# Altium schematic sheet Main.SchDoc
size 594 x 420 mm; SheetNumber: 1; SheetTotal: 1
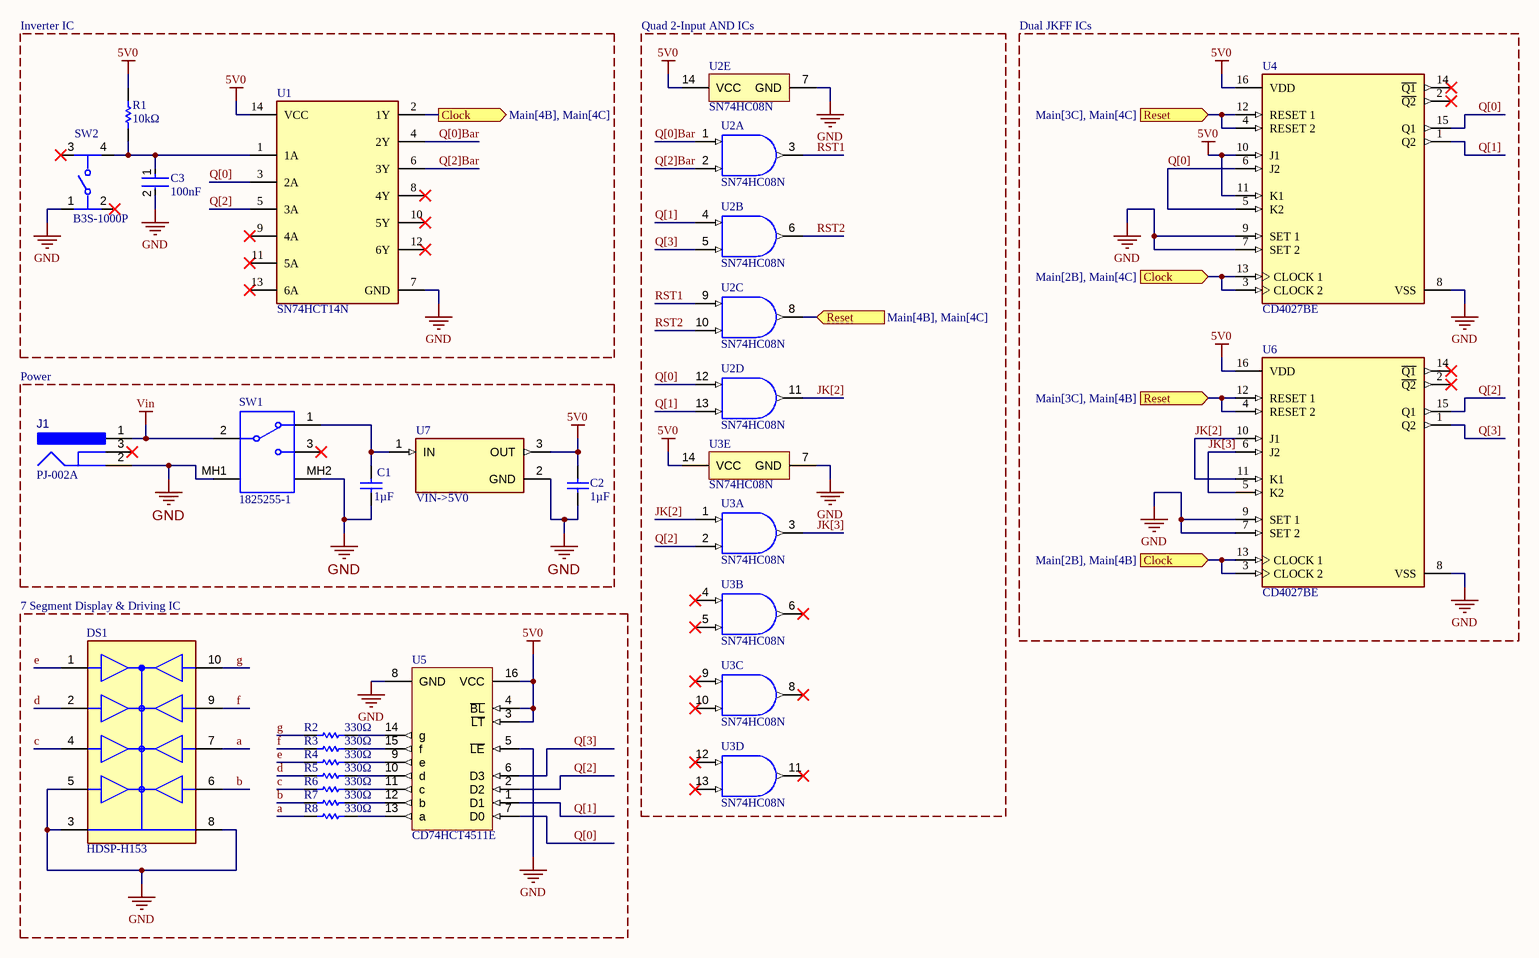
[diagram p0: Main.SchDoc]

## Parts
C1  1µF  [CAPC3216X110X50LL20T25]
C2  1µF  [CAPC3216X110X50LL20T25]
C3  100nF  [FP-C1206C-EB-MFG]
DS1  HDSP-H153  [FP-HDSP-H153-MFG]
J1  PJ-002A  [CUI-PJ-002A_V]
R1  10kΩ  [RESC3116X65X40ML10T20]
R2  330Ω  [RESC3216X70X50NL05T20]
R3  330Ω  [RESC3216X70X50NL05T20]
R4  330Ω  [RESC3216X70X50NL05T20]
R5  330Ω  [RESC3216X70X50NL05T20]
R6  330Ω  [RESC3216X70X50NL05T20]
R7  330Ω  [RESC3216X70X50NL05T20]
R8  330Ω  [RESC3216X70X50NL05T20]
SW1  1825255-1  [TECO-1825255-1_V]
SW2  B3S-1000P  [FP-B3S-1000P-MFG]
U1  SN74HCT14N  [FP-N0014A-MFG]
U2  SN74HC08N  [N0014A]  (parts A,B,C,D,E of 5)
U3  SN74HC08N  [N0014A]  (parts A,B,C,D,E of 5)
U4  CD4027BE  [FP-N0016A-MFG]
U5  CD74HCT4511E  [N0016A]
U6  CD4027BE  [FP-N0016A-MFG]
U7  VIN->5V0  [DPAK229P990X238-4N]

## Blocks framed on the sheet
Inverter IC: C3 R1 SW2 U1
Quad 2-Input AND ICs: U2 U3
Dual JKFF ICs: U4 U6
Power: C1 C2 J1 SW1 U7
7 Segment Display & Driving IC: DS1 R2-R8 U5

## Ports
Clock (in, see Main[2B], Main[4B]), Clock (in, see Main[2B], Main[4C]), Clock (out, see Main[4B], Main[4C]), Reset (in, see Main[3C], Main[4B]), Reset (in, see Main[3C], Main[4C]), Reset (in, see Main[4B], Main[4C])

## Nets
5V0: C2.1 R1.2 U1.14(VCC) U2.14(VCC) U3.14(VCC) U4.10(J1) U4.11(K1) U4.16(VDD) U5.3(~{LT}) U5.4(~{BL}) U5.16(VCC) U6.16(VDD) U7.3(OUT)
GND: C1.2 C2.2 C3.2 DS1.3(C) DS1.5(ANODE_DP) DS1.8(C) J1.2 SW1.MH1 SW1.MH2 SW2.1 U1.7(GND) U2.7(GND) U3.7(GND) U4.7(SET_2) U4.8(VSS) U4.9(SET_1) U5.5(~{LE}) U5.8(GND) U6.7(SET_2) U6.8(VSS) U6.9(SET_1) U7.2(GND)
Vin: J1.1 SW1.2
a: DS1.7(ANODE_a) R8.1
b: DS1.6(ANODE_b) R7.1
c: DS1.4(ANODE_c) R6.1
Clock: U1.2(1Y) U4.3(CLOCK_2) U4.13(CLOCK_1) U6.3(CLOCK_2) U6.13(CLOCK_1) ; port Clock
d: DS1.2(ANODE_d) R5.1
e: DS1.1(ANODE_e) R4.1
f: DS1.9(ANODE_f) R3.1
g: DS1.10(ANODE_g) R2.1
JK[2]: U2.11(4Y) U3.1(1A) U6.10(J1) U6.11(K1)
JK[3]: U3.3(1Y) U6.5(K2) U6.6(J2)
Q[0]: U1.3(2A) U2.12(4A) U4.5(K2) U4.6(J2) U4.15(Q1) U5.7(D0)
Q[0]Bar: U1.4(2Y) U2.1(1A)
Q[1]: U2.4(2A) U2.13(4B) U4.1(Q2) U5.1(D1)
Q[2]: U1.5(3A) U3.2(1B) U5.2(D2) U6.15(Q1)
Q[2]Bar: U1.6(3Y) U2.2(1B)
Q[3]: U2.5(2B) U5.6(D3) U6.1(Q2)
Reset: U2.8(3Y) U4.4(RESET_2) U4.12(RESET_1) U6.4(RESET_2) U6.12(RESET_1) ; port Reset
RST1: U2.3(1Y) U2.9(3A)
RST2: U2.6(2Y) U2.10(3B)
NetC1_1: C1.1 SW1.1 U7.1(IN)
NetC3_1: C3.1 R1.1 SW2.4 U1.1(1A)
NetR2_2: R2.2 U5.14(g)
NetR3_2: R3.2 U5.15(f)
NetR4_2: R4.2 U5.9(e)
NetR5_2: R5.2 U5.10(d)
NetR6_2: R6.2 U5.11(c)
NetR7_2: R7.2 U5.12(b)
NetR8_2: R8.2 U5.13(a)

Not connected (* = marked no-connect by the designer): J1 3*; SW1 3*; SW2 2* 3*; U1 8(4Y)* 9(4A)* 10(5Y)* 11(5A)* 12(6Y)* 13(6A)*; U3 4(2A)* 5(2B)* 6(2Y)* 8(3Y)* 9(3A)* 10(3B)* 11(4Y)* 12(4A)* 13(4B)*; U4 2(~{Q2})* 14(~{Q1})*; U6 2(~{Q2})* 14(~{Q1})*

## Library data of the parts
C1 C2 = CMP-2000-06011-1: Chip Capacitor, 1 uF, +/- 10%, 50 V, -55 to 125 degC, 1206 (3216 Metric), RoHS, Tape and Reel; Manufacturer: Kemet; Case Height: 1mm; Dielectric: X7R; Voltage Rating: 50V; Capacitance: 1uF; Temperature Coefficient / Code: +/-15%; Case Length: 3.2mm; Case Width: 1.6mm; Type: SMDMLCCX7R6.3-250VDCCommericalGrade; Class: Class1; Capacitance - nF: 1000nF; Datasheet URL: http://www.kemet.com/docfinder?Partnumber=C1206C105K5RACTU; Product Category: MultilayerCeramicCapacitorsMLCC-SMD/SMT; Termination Style: SMD/SMT; Dimensions: 1.6mmWx3.2mmLx1mmH; Voltage Rating DC: 50V; Datasheet Version: 02/2016; Packaging: Reel; Brand: Kemet; RoHS: Details; Minimum Operating Temperature: -55C; Operating Temperature Range: -55Cto+125C; Package Reference: 1206; Manufacturer URL: http://www.kemet.com/; Product: GeneralTypeMLCCs; Tolerance: 10%; Package Description: 2-Pin Surface Mount Device, Body 3.2 x 1.6 mm; Mounting Technology: SurfaceMount; Case Code - mm: 3216; Maximum Operating Temperature: +125C; Series: C1206C; Factory Pack Quantity: 2500; Package / Case: 1206(3216metric); Case Code - in: 1206
C3 = CMP-1037-04222-2: CAP CER 0.1UF 200V 10% X7R 1206; Manufacturer Part Number: C1206C104K2RACTU; Manufacturer: KEMET; Automotive Grade: Grade 0; Tolerance: 0.1; Value: 0.10 μF; Material: Ceramic; Temperature Coefficient: 15%; Automotive: Yes; Temperature Characteristic: X7R; Digikey Description: CAP CER 0.1UF 200V 10% X7R 1206; ComponentLink2URL: https://content.kemet.com/datasheets/KEM_C1007_X8R_ULTRA_150C_SMD.pdf; Voltage Rating: 200 V; Temperature Range High: +150°C; Device Class L1: Passive Components; Octopart: https://octopart.com/c1206c104k2ractu-kemet-9138344; Temperature: -55°C to +150°C; Height: 0.88mm; Device Class L3: Ceramic Capacitors; Lead Free: Yes; Package: C1206C-EB; Category: Cap; Temperature Range Low: -55°C; Mouser Description: Multilayer Ceramic Capacitors MLCC - SMD/SMT 200volts 0.1uF X7R 10%; Ipc Land Pattern Name: CAPC320160X78; Capacitance: 0.10 μF; RoHS: TRUE; ComponentLink2Description: Datasheet; Device Class L2: Capacitors
DS1 = CMP-18395-000002-1: LED 7-SEG 14.2MM CC RED RHD RHD; Manufacturer: Broadcom; Wavelength: 637nm; Power Dissipation: 96mW; Standoff Height: 1.14mm; Luminous Intensity: 16mcd; Test Current: 100mA; Element Config: Common Cathode; Reverse Voltage: 15V; Viewing Angle: 100°; Forward Voltage: 2V; Device Class L2: Displays; Temperature Range High: +100°C; ComponentLink2Description: Datasheet; Device Class L3: LED Displays; Automotive: No; Digikey Description: LED 7-SEG 14.2MM CC RED RHD RHD; Display Type: LED; Lead Free: Yes; Category: Disp; Package: HDSP-H153; Height: 8mm; Octopart: https://octopart.com/hdsp-h153-broadcom-71129578; RoHS: TRUE; Device Class L1: Optoelectronics; Manufacturer Part Number: HDSP-H153; Temperature: -20°C to +100°C; ComponentLink2URL: https://docs.broadcom.com/docs/AV02-1107EN; Forward Current: 100mA; Temperature Range Low: -20°C
J1 = CMP-2000-06895-2: Through Hole Right Angle DC Power Jack, 2.5 A, 2 mm Center Pin, 3 Position, -25 to 85 degC, RoHS, Bulk; Manufacturer: CUIInc.; Brand: CUI; Inside Contact Diameter: 2mm; Voltage Rating: 24V; Outside Contact Diameter: 6.5mm; Current Rating: 2.5A; Insulation Resistance: 50MOhms; Contact Gender: Male; Connector Type: DCPowerJack; Datasheet Version: Rev. 1.03, 04/2016; Housing Material: PolybutyleneTerephthalate(PBT); Operating Temperature Range: -25Cto+85C; Termination Style: ThroughHole; Product Category: DCPowerConnectors; Mounting Technology: ThroughHole; Mounting Style: ThroughHole; Factory Pack Quantity: 500; Contact Plating: Nickel; Package Reference: PJ-002A; Mounting Angle: Right; Package Description: 3-Pin Through Hole Device, Body 14.4 x 9 mm, Height 11 mm; Flammability Rating: UL94V-0; Manufacturer URL: http://www.cui.com/; Product: Jacks; Contact Material: Copper; Datasheet URL: http://www.cui.com/product/resource/pj-002a.pdf; RoHS: True
R1 = CMP-1014-00623-2: Chip Resistor, 10 KOhm, +/- 1%, 0.25 W, -55 to 155 degC, 1206 (3216 Metric), RoHS, Tape and Reel; Manufacturer: Yageo; Voltage Rating: 200V; Resistance: 10KOhm; Temperature Coefficient: 100ppm/degreesC; Power Rating: 250mW; Packaging: TapeandReel; Termination: SMD/SMT; REACH SVHC: Unknown; Tolerance: 1%; Height: 0.55mm; Composition: ThickFilm; Max Operating Temperature: 155degC; Datasheet Version: Rev. 5, 10/2016; Lead Free: LeadFree; Case Code (Metric): 3216; Depth: 1.6mm; Package Quantity: 5000; RoHSCompliant: true; Military Standard: Not; Case/Package: 1206; Case Code (Imperial): 1206; Min Operating Temperature: -55degC; Datasheet URL: http://www.yageo.com/NewPortal/yageodocoutput?fileName=/pdf/R-Chip/PYu-RC_Group_51_RoHS_L_5.pdf; Length: 3.1mm; Manufacturer URL: http://www.yageo.com/; Package Reference: 1206.0; Width: 1.6mm; Package Description: 2-Pin Surface Mount Device, Body 3.1 x 1.6 mm
R2-R8 = CMP-2003-00307-1: Part Number: ERJ8ENF3300V; Manufacturer: Panasonic
SW1 = CMP-2100-03576-1: Slide Switch, SPDT, 125 V, -20 to 85 degC, 5-Pin THD, RoHS, Tray; Manufacturer: TE Connectivity; Electrical Life: 15000Cycles; Number of Positions: 2; Operating Force: 600gf; Max Voltage Rating (AC): 125V; Actuator Length: 4.5mm; Current Rating: 300mA; Contact Style: Shorting; Switch Travel: 4mm; Flammability Rating: UL94HB; Termination: PCPins; Package Quantity: 560; Throw Configuration: SPDT; Datasheet Version: Rev. A4, 03/2014; Mount: ThroughHole; Package Reference: 1825255-1; Case/Package: 300; Depth: 6.7mm; Packaging: Bulk; Package Description: 5-Pin Through Hole Device, Body 6.7 x 16 mm, Pitch 4 mm; REACH SVHC: Unknown; ELV: Compliant; Voltage Rating (AC): 125V; Max Current Rating: 300mA; Radiation Hardening: No; Min Operating Temperature: -20degC; Contact Plating: Silver; Length: 16mm; Manufacturer URL: http://www.te.com/; Orientation: Vertical; Contact Material: Copper; RoHSCompliant: true; Lead Free: LeadFree; Max Operating Temperature: 85degC; Datasheet URL: http://www.te.com/commerce/DocumentDelivery/DDEController?Action=showdoc&DocId=Customer+Drawing%7F1825255%7FA4%7Fpdf%7FEnglish%7FENG_CD_1825255_A4_baseFilename.pdf%7F1825255-1
SW2 = CMP-08834-000008-1: SWITCH TACTILE SPST-NO 0.05A 24V; Throw Configuration: SPST; Switch Function: Off-Mom; Switch Travel: 0.25mm; Contact Current Rating: 50mA; Actuator Length: 0.8mm; Mechanical Life: 500000Cycles; Contact Resistance: 100mR; Operating Force: 1.57N; Actuator Type: Standard; Illumination Type: Non-Illuminated; Ratings: IP67; Number of Poles: 1; Package Quantity: 1; Orientation: Straight; REACH SVHC: No SVHC; Lead Free: Lead Free; Max Current Rating: 50mA; Contact Plating: Silver; Current Rating: 50mA; Depth: 9mm; Contact Material: Bronze; Electrical Life: 500000Cycles; Termination: Gull Wing; Width: 6mm; Packaging: Tape and Reel; Min Operating Temperature: -25°C; Radiation Hardening: No; Max Voltage Rating (DC): 24V; Max Operating Temperature: 70°C; Length: 6.6mm; Height: 3.65mm; Voltage Rating (DC): 24V; Weight: 0.010582oz; Mount: Surface Mount
U1 = CMP-1615-00871-4: IC INVERTER SCHMITT 6CH 14DIP; Low Level Output Current: 4mA; Schmitt Trigger Input: Yes; Turn-On Delay Time: 40ns; Operating Supply Voltage: 5V; Logic Function: Buffer; Quiescent Current: 2uA; Propagation Delay: 30ns; Input Type: SCHMITT TRIGGER; Number of Bits: 6; High Level Output Current: -4mA; Max Supply Voltage: 5.5V; Number of Inputs: 1; Min Supply Voltage: 4.5V; Number of Pins: 14; Length: 19.3mm; Weight: 0.032734oz; Output Current: 4mA; Width: 6.35mm; Height: 4.57mm; Radiation Hardening: No; Max Operating Temperature: 85°C; REACH SVHC: No SVHC; Min Operating Temperature: -40°C; Series: 74HCT; Package Quantity: 25; Number of Elements: 6; Packaging: Rail/Tube; RoHS Compliant: Yes; Lead Free: Lead Free; Contact Plating: Gold; Case/Package: PDIP; Technology: CMOS; Number of Circuits: 6; Number of Gates: 6; Mount: Through Hole; Max Output Current: 4mA
U2 U3 = CMP-0777-00250-3: Quadruple 2-Input Positive-AND Gates, N0014A, TUBE; Manufacturer: Texas Instruments; Output Type: CMOS; ICC @ Nom Voltage(Max)(mA): 0.02; tpd @ Nom Voltage(Max)(ns): 28; Voltage(Nom)(V): 5; VCC(Min)(V): 2; Technology Family: HC; F @ Nom Voltage(Max)(Mhz): 70; Rating: Catalog; Bits(#): 4; Schmitt Trigger: No; VCC(Max)(V): 6; PackageReference: N0014A; Input Type: CMOS; Generic Part Number: SN74HC08; DatasheetVersion: SCLS081F; Operating Temperature Range(C): -40 to 85
U4 U6 = CMP-04902-000022-1: IC FF JK TYPE DUAL 1BIT 16DIP; Min Supply Voltage: 3V; Input Type: SINGLE-ENDED; Clock Edge Trigger Type: Positive Edge; Output Current: 6.8mA; Polarity: Non-Inverting; High Level Output Current: -4.2mA; Number of Bits per Element: 1; Input Capacitance: 5pF; Operating Supply Voltage: 3.3V; Logic Function: Flip-Flop; Low Level Output Current: 4.2mA; Number of Circuits: 2; Max Frequency: 24MHz; Turn-On Delay Time: 45ns; Propagation Delay: 300ns; Quiescent Current: 20uA; Max Supply Voltage: 18V; Power Dissipation: 500mW; Lead Free: Lead Free; Technology: CMOS; Radiation Hardening: No; Width: 6.35mm; Packaging: Rail/Tube; Height: 4.57mm; Number of Pins: 16; RoHS Compliant: Yes; Contact Plating: Gold; Length: 19.3mm; Number of Elements: 2; Max Operating Temperature: 125°C; Number of Input Lines: 2; Package Quantity: 25; REACH SVHC: No SVHC; Weight: 0.03357oz; Number of Bits: 2; Mount: Through Hole; Min Operating Temperature: -55°C; Number of Output Lines: 1; Case/Package: PDIP; Frequency: 24MHz; Series: 4000B
U5 = CMP-0388-00318-2: High Speed CMOS Logic BCD-to-7-Segment Latch / Decoder / Driver, 4.5 to 5.5 V, -55 to 125 degC, 16-pin DIP (N16), Pb-Free (RoHS); Manufacturer: Texas Instruments; SubFamily: Discrete Segment LED Driver; Rating: Catalog; Vin(Min)(V): 4.5; Vin(Max)(V): 5.5; PackageDescription: 16-Pin Plastic In-Line, Body 19.305 x 6.35 mm, Pitch 2.54 mm; ComponentLink3URL: http://www.ti.com/litv/pdf/mpdi002c; PackageVersion: 4040049/E; Mounting Technology: Through Hole; ComponentLink2Description: Datasheet; PartNumber: CD74HCT4511E; DatasheetVersion: SCHS279D; ComponentLink1Description: Manufacturer URL; Eco-Plan: Pb-Free (RoHS); Code_JEDEC: MS-001; PackageReference: N0016A; ComponentLink2URL: http://www.ti.com/general/docs/lit/getliterature.tsp?genericPartNumber=CD74HCT4511&fileType=pdf; ComponentLink3Description: Package Specification; ComponentLink1URL: http://www.ti.com/
U7 = MC7805BDTRKG: Linear Voltage Regulator IC 1 Output 1A DPAK; MF: ON Semiconductor; MP: MC7805BDTRKG; Package: TO-252-3 Freescale Semiconductor; Price: None; Availability: Unavailable; Value: *; SnapEDA_Link: https://www.snapeda.com/parts/MC7805BDTRKG/ON%20Semiconductor/view-part/360207/?ref=snap